# Altium project FLEXIBLE_SENSOR_HOLDER.PrjPcb
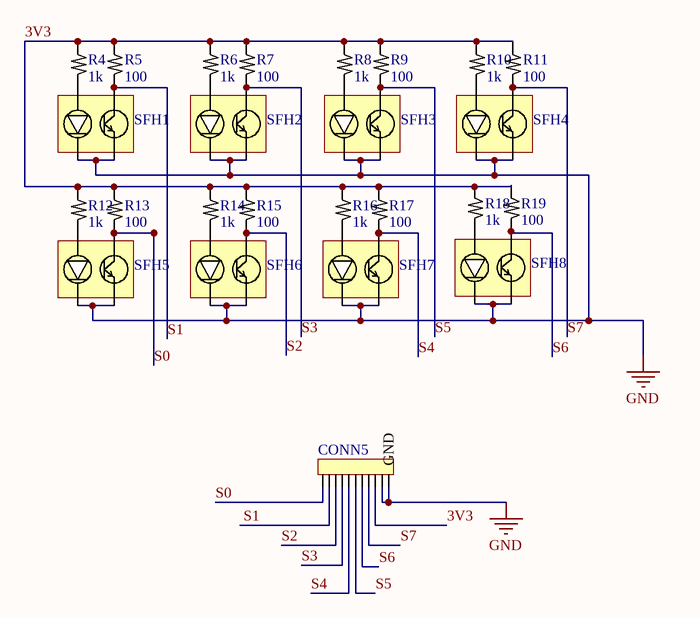
[diagram p0: FlexiblePart.SchDoc]
1 sheet, 25 parts. Net scope: global (net labels, ports and power ports of the same name join across sheets).
Board file: FlexiblePartNoPowerPlanes.PcbDoc

## Sheet FlexiblePart.SchDoc
size A4

### Parts
CONN5  10_pin_connector  [10Pin_1mmpitch_FFC_FCP_ZIF]  (value not drawn)
R4  1k  [Resistor_1608]
R5  100  [Resistor_1608]
R6  1k  [Resistor_1608]
R7  100  [Resistor_1608]
R8  1k  [Resistor_1608]
R9  100  [Resistor_1608]
R10  1k  [Resistor_1608]
R11  100  [Resistor_1608]
R12  1k  [Resistor_1608]
R13  100  [Resistor_1608]
R14  1k  [Resistor_1608]
R15  100  [Resistor_1608]
R16  1k  [Resistor_1608]
R17  100  [Resistor_1608]
R18  1k  [Resistor_1608]
R19  100  [Resistor_1608]
SFH1  SFH 7250  [SFH_SENSOR_34x30]  (value not drawn)
SFH2  SFH 7250  [SFH_SENSOR_34x30]  (value not drawn)
SFH3  SFH 7250  [SFH_SENSOR_34x30]  (value not drawn)
SFH4  SFH 7250  [SFH_SENSOR_34x30]  (value not drawn)
SFH5  SFH 7250  [SFH_SENSOR_34x30]  (value not drawn)
SFH6  SFH 7250  [SFH_SENSOR_34x30]  (value not drawn)
SFH7  SFH 7250  [SFH_SENSOR_34x30]  (value not drawn)
SFH8  SFH 7250  [SFH_SENSOR_34x30]  (value not drawn)

### Nets
GND: CONN5.10 CONN5.GND SFH1.LED_Cathode SFH1.PhT_Emitter SFH2.LED_Cathode SFH2.PhT_Emitter SFH3.LED_Cathode SFH3.PhT_Emitter SFH4.LED_Cathode SFH4.PhT_Emitter SFH5.LED_Cathode SFH5.PhT_Emitter SFH6.LED_Cathode SFH6.PhT_Emitter SFH7.LED_Cathode SFH7.PhT_Emitter SFH8.LED_Cathode SFH8.PhT_Emitter
3V3: CONN5.9 R4.Res_p1 R5.Res_p1 R6.Res_p1 R7.Res_p1 R8.Res_p1 R9.Res_p1 R10.Res_p1 R11.Res_p1 R12.Res_p1 R13.Res_p1 R14.Res_p1 R15.Res_p1 R16.Res_p1 R17.Res_p1 R18.Res_p1 R19.Res_p1
S0: CONN5.1 R13.Res_p2 SFH5.PhT_Collector
S1: CONN5.2 R5.Res_p2 SFH1.PhT_Collector
S2: CONN5.3 R15.Res_p2 SFH6.PhT_Collector
S3: CONN5.4 R7.Res_p2 SFH2.PhT_Collector
S4: CONN5.5 R17.Res_p2 SFH7.PhT_Collector
S5: CONN5.6 R9.Res_p2 SFH3.PhT_Collector
S6: CONN5.7 R19.Res_p2 SFH8.PhT_Collector
S7: CONN5.8 R11.Res_p2 SFH4.PhT_Collector
NetR4_Res_p2: R4.Res_p2 SFH1.LED_Anode
NetR6_Res_p2: R6.Res_p2 SFH2.LED_Anode
NetR8_Res_p2: R8.Res_p2 SFH3.LED_Anode
NetR10_Res_p2: R10.Res_p2 SFH4.LED_Anode
NetR12_Res_p2: R12.Res_p2 SFH5.LED_Anode
NetR14_Res_p2: R14.Res_p2 SFH6.LED_Anode
NetR16_Res_p2: R16.Res_p2 SFH7.LED_Anode
NetR18_Res_p2: R18.Res_p2 SFH8.LED_Anode

### Library data of the parts
CONN5 = 10_pin_connector: 10 Pin Connector
R4-R19 = Resistor_SMD: SMD Resistor; Manifacturer: Vishay
SFH1-SFH8 = Photoreflector: Infrared Emitter - PhTransistor Receiver; Manifacturer: OSram